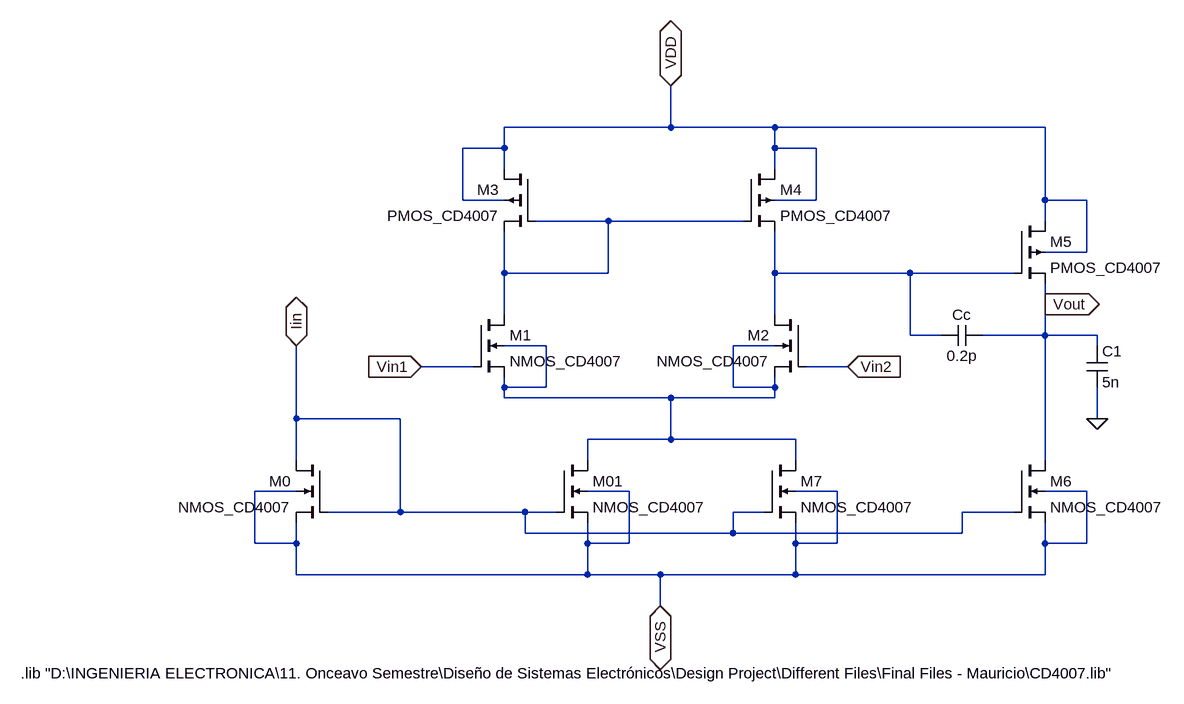
[diagram p0: schematic OTA_symbol.asc]
OTA_symbol.asc, the LTspice schematic file:
Version 4
SHEET 1 2096 948
WIRE 1184 -64 1184 -128
WIRE 1184 -64 928 -64
WIRE 1344 -64 1184 -64
WIRE 1760 -64 1344 -64
WIRE 928 -32 928 -64
WIRE 928 -32 864 -32
WIRE 1344 -32 1344 -64
WIRE 1408 -32 1344 -32
WIRE 928 0 928 -32
WIRE 1344 0 1344 -32
WIRE 864 48 864 -32
WIRE 928 48 864 48
WIRE 1408 48 1408 -32
WIRE 1408 48 1344 48
WIRE 1760 48 1760 -64
WIRE 1824 48 1760 48
WIRE 1088 80 976 80
WIRE 1296 80 1088 80
WIRE 1760 80 1760 48
WIRE 1824 128 1824 48
WIRE 1824 128 1760 128
WIRE 928 160 928 96
WIRE 1088 160 1088 80
WIRE 1088 160 928 160
WIRE 1344 160 1344 96
WIRE 1552 160 1344 160
WIRE 1712 160 1552 160
WIRE 1760 208 1760 176
WIRE 928 224 928 160
WIRE 1344 224 1344 160
WIRE 1552 256 1552 160
WIRE 1600 256 1552 256
WIRE 1760 256 1760 208
WIRE 1760 256 1664 256
WIRE 1840 256 1760 256
WIRE 992 272 928 272
WIRE 1344 272 1280 272
WIRE 1840 272 1840 256
WIRE 880 304 800 304
WIRE 1456 304 1392 304
WIRE 928 336 928 320
WIRE 992 336 992 272
WIRE 992 336 928 336
WIRE 1280 336 1280 272
WIRE 1344 336 1344 320
WIRE 1344 336 1280 336
WIRE 928 352 928 336
WIRE 1184 352 928 352
WIRE 1344 352 1344 336
WIRE 1344 352 1184 352
WIRE 608 384 608 272
WIRE 768 384 608 384
WIRE 1840 384 1840 336
WIRE 1184 416 1184 352
WIRE 1184 416 1056 416
WIRE 1376 416 1184 416
WIRE 608 448 608 384
WIRE 1056 448 1056 416
WIRE 1376 448 1376 416
WIRE 1760 448 1760 256
WIRE 608 496 544 496
WIRE 1120 496 1056 496
WIRE 1440 496 1376 496
WIRE 1824 496 1760 496
WIRE 768 528 768 384
WIRE 768 528 656 528
WIRE 960 528 768 528
WIRE 1008 528 960 528
WIRE 1328 528 1280 528
WIRE 1712 528 1632 528
WIRE 960 560 960 528
WIRE 1280 560 1280 528
WIRE 1280 560 960 560
WIRE 1632 560 1632 528
WIRE 1632 560 1280 560
WIRE 544 576 544 496
WIRE 608 576 608 544
WIRE 608 576 544 576
WIRE 1056 576 1056 544
WIRE 1120 576 1120 496
WIRE 1120 576 1056 576
WIRE 1376 576 1376 544
WIRE 1440 576 1440 496
WIRE 1440 576 1376 576
WIRE 1760 576 1760 544
WIRE 1824 576 1824 496
WIRE 1824 576 1760 576
WIRE 608 624 608 576
WIRE 1056 624 1056 576
WIRE 1056 624 608 624
WIRE 1168 624 1056 624
WIRE 1376 624 1376 576
WIRE 1376 624 1168 624
WIRE 1760 624 1760 576
WIRE 1760 624 1376 624
WIRE 1168 672 1168 624
FLAG 1184 -128 VDD
IOPIN 1184 -128 BiDir
FLAG 800 304 Vin1
IOPIN 800 304 In
FLAG 1456 304 Vin2
IOPIN 1456 304 In
FLAG 1840 384 0
FLAG 608 272 Iin
IOPIN 608 272 BiDir
FLAG 1760 208 Vout
IOPIN 1760 208 Out
FLAG 1168 672 VSS
IOPIN 1168 672 BiDir
DATAFLAG 1184 352 ""
DATAFLAG 928 160 ""
DATAFLAG 1344 160 ""
DATAFLAG 1280 560 ""
DATAFLAG 1536 160 ""
DATAFLAG 848 304 ""
DATAFLAG 1424 304 ""
DATAFLAG 1760 256 ""
DATAFLAG 624 384 ""
DATAFLAG 1728 256 ""
DATAFLAG 1248 -64 ""
SYMBOL nmos4 880 224 R0
SYMATTR InstName M1
SYMATTR Value NMOS_CD4007
SYMATTR Value2 L=5u W=170u Ad=8500p As=8500p Pd=440u Ps=440u NRD=0.1 NRS=0.1
SYMBOL nmos4 1392 224 M0
SYMATTR InstName M2
SYMATTR Value NMOS_CD4007
SYMATTR Value2 L=5u W=170u Ad=8500p As=8500p Pd=440u Ps=440u NRD=0.1 NRS=0.1
SYMBOL pmos4 976 0 M0
SYMATTR InstName M3
SYMATTR Value PMOS_CD4007
SYMATTR Value2 L=5u W=360u Ad=18000p As=18000p Pd=820u Ps=820u NRS=0.54 NRD=0.54
SYMBOL pmos4 1296 0 R0
SYMATTR InstName M4
SYMATTR Value PMOS_CD4007
SYMATTR Value2 L=5u W=360u Ad=18000p As=18000p Pd=820u Ps=820u NRS=0.54 NRD=0.54
SYMBOL pmos4 1712 80 R0
SYMATTR InstName M5
SYMATTR Value PMOS_CD4007
SYMATTR Value2 L=5u W=360u Ad=18000p As=18000p Pd=820u Ps=820u NRS=0.54 NRD=0.54
SYMBOL nmos4 1712 448 R0
SYMATTR InstName M6
SYMATTR Value NMOS_CD4007
SYMATTR Value2 L=5u W=170u Ad=8500p As=8500p Pd=440u Ps=440u NRD=0.1 NRS=0.1
SYMBOL nmos4 1328 448 R0
SYMATTR InstName M7
SYMATTR Value NMOS_CD4007
SYMATTR Value2 L=5u W=170u Ad=8500p As=8500p Pd=440u Ps=440u NRD=0.1 NRS=0.1
SYMBOL nmos4 656 448 M0
SYMATTR InstName M0
SYMATTR Value NMOS_CD4007
SYMATTR Value2 L=5u W=170u Ad=8500p As=8500p Pd=440u Ps=440u NRD=0.1 NRS=0.1
SYMBOL nmos4 1008 448 R0
SYMATTR InstName M01
SYMATTR Value NMOS_CD4007
SYMATTR Value2 L=5u W=170u Ad=8500p As=8500p Pd=440u Ps=440u NRD=0.1 NRS=0.1
SYMBOL cap 1664 240 R90
WINDOW 0 0 32 VBottom 2
WINDOW 3 32 32 VTop 2
SYMATTR InstName Cc
SYMATTR Value 0.2p
SYMBOL cap 1824 272 R0
SYMATTR InstName C1
SYMATTR Value 5n
TEXT 184 776 Left 2 !.lib "D:\\INGENIERIA ELECTRONICA\\11. Onceavo Semestre\\Diseño de Sistemas Electrónicos\\Design Project\\Different Files\\Final Files - Mauricio\\CD4007.lib"

The netlist it stands for:
* OTA_symbol.asc
M1 N001 Vin1 N003 N003 NMOS_CD4007 L=5u W=170u Ad=8500p As=8500p Pd=440u Ps=440u NRD=0.1 NRS=0.1
M2 N002 Vin2 N003 N003 NMOS_CD4007 L=5u W=170u Ad=8500p As=8500p Pd=440u Ps=440u NRD=0.1 NRS=0.1
M3 VDD N001 N001 VDD PMOS_CD4007 L=5u W=360u Ad=18000p As=18000p Pd=820u Ps=820u NRS=0.54 NRD=0.54
M4 VDD N001 N002 VDD PMOS_CD4007 L=5u W=360u Ad=18000p As=18000p Pd=820u Ps=820u NRS=0.54 NRD=0.54
M5 VDD N002 Vout VDD PMOS_CD4007 L=5u W=360u Ad=18000p As=18000p Pd=820u Ps=820u NRS=0.54 NRD=0.54
M6 Vout Iin VSS VSS NMOS_CD4007 L=5u W=170u Ad=8500p As=8500p Pd=440u Ps=440u NRD=0.1 NRS=0.1
M7 N003 Iin VSS VSS NMOS_CD4007 L=5u W=170u Ad=8500p As=8500p Pd=440u Ps=440u NRD=0.1 NRS=0.1
M0 Iin Iin VSS VSS NMOS_CD4007 L=5u W=170u Ad=8500p As=8500p Pd=440u Ps=440u NRD=0.1 NRS=0.1
M01 N003 Iin VSS VSS NMOS_CD4007 L=5u W=170u Ad=8500p As=8500p Pd=440u Ps=440u NRD=0.1 NRS=0.1
Cc Vout N002 0.2p
C1 Vout 0 5n
.model NMOS NMOS
.model PMOS PMOS
.lib standard.mos
.lib "D:\INGENIERIA ELECTRONICA\11. Onceavo Semestre\Diseño de Sistemas Electrónicos\Design Project\Different Files\Final Files - Mauricio\CD4007.lib"
.backanno
.end